# Altium schematic sheet COMMUNICATION.SchDoc
size 420 x 297 mm; SheetNumber: 4; SheetTotal: 5
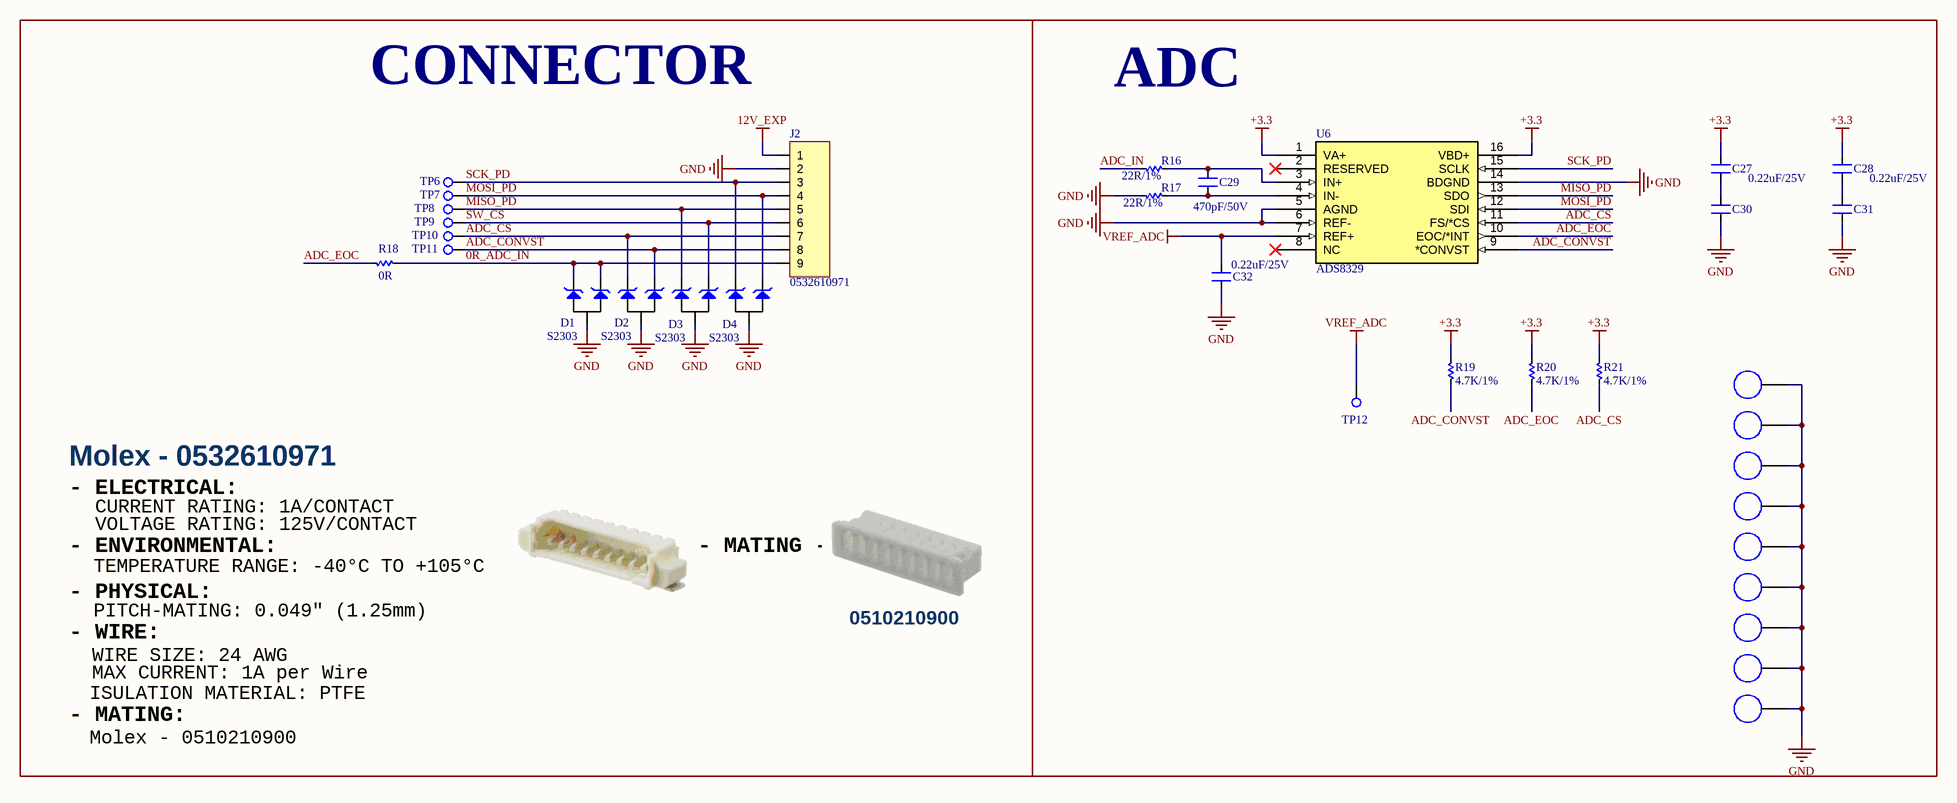
[diagram p0: COMMUNICATION.SchDoc]

## Parts
C27  0.22uF/25V  [CN-SMD-0603]
C28  0.22uF/25V  [CN-SMD-0603]
C29  470pF/50V  [CN-SMD-0603]
C30  0.22uF/25V  [CN-SMD-0603]  (value not drawn)
C31  0.22uF/25V  [CN-SMD-0603]  (value not drawn)
C32  0.22uF/25V  [CN-SMD-0603]
D1  S2303  [SOT23-123]
D2  S2303  [SOT23-123]
D3  S2303  [SOT23-123]
D4  S2303  [SOT23-123]
H1  HOLD  [M3 - 6mm]  (value not drawn)
H2  HOLD  [M3 - 6mm]  (value not drawn)
H3  HOLD  [M3 - 6mm]  (value not drawn)
H4  HOLD  [M3 - 6mm]  (value not drawn)
H5  HOLD  [M3 - 6mm]  (value not drawn)
H6  HOLD  [M3 - 6mm]  (value not drawn)
H7  HOLD  [M3 - 6mm]  (value not drawn)
H8  HOLD  [M3 - 6mm]  (value not drawn)
H9  HOLD  [M3 - 6mm]  (value not drawn)
J2  0532610971  [0532610971]
R16  22R/1%  [RES-SMD-0603]
R17  22R/1%  [RES-SMD-0603]
R18  0R  [RES-SMD-0603]
R19  4.7K/1%  [RES-SMD-0603]
R20  4.7K/1%  [RES-SMD-0603]
R21  4.7K/1%  [RES-SMD-0603]
TP6  Test_Point  [TESTPOINT]  (value not drawn)
TP7  Test_Point  [TESTPOINT]  (value not drawn)
TP8  Test_Point  [TESTPOINT]  (value not drawn)
TP9  Test_Point  [TESTPOINT]  (value not drawn)
TP10  Test_Point  [TESTPOINT]  (value not drawn)
TP11  Test_Point  [TESTPOINT]  (value not drawn)
TP12  Test_Point  [TESTPOINT]  (value not drawn)
U6  ADS8329  [TSSOP16]

## Blocks framed on the sheet
CONNECTOR: D1-D4 J2 R18 TP6-TP11
ADC: C27-C32 H1-H9 R16 R17 R19-R21 TP12 U6

## Nets
12V_EXP: J2.1
+3.3: C27.2 C28.2 R19.2 R20.2 R21.2 U6.1(VA+) U6.16(VBD+)
GND: C30.1 C31.1 C32.1 D1.2 D2.2 D3.2 D4.2 H1.1 H2.1 H3.1 H4.1 H5.1 H6.1 H7.1 H8.1 H9.1 J2.2 R17.2 U6.5(AGND) U6.6(REF-) U6.14(BDGND)
VREF_ADC: C32.2 TP12.1 U6.7(REF+)
0R_ADC_IN: D1.1 D1.3 J2.9 R18.1
ADC_CONVST: D2.3 J2.8 R19.1 TP11.1 U6.9(*CONVST)
ADC_CS: D2.1 J2.7 R21.1 TP10.1 U6.11(FS/*CS)
ADC_EOC: R18.2 R20.1 U6.10(EOC/*INT)
ADC_IN: R16.2
MISO_PD: D3.1 J2.5 TP8.1 U6.13(SDO)
MOSI_PD: D4.3 J2.4 TP7.1 U6.12(SDI)
SCK_PD: D4.1 J2.3 TP6.1 U6.15(SCLK)
SW_CS: D3.3 J2.6 TP9.1
NetC27_1: C27.1 C30.2
NetC28_1: C28.1 C31.2
NetC29_1: C29.1 R17.1 U6.4(IN-)
NetC29_2: C29.2 R16.1 U6.3(IN+)

Not connected (* = marked no-connect by the designer): U6 2(RESERVED)* 8(NC)*

## Notes on the sheet
- Molex - 0532610971
- - ELECTRICAL:
- - ENVIRONMENTAL:
- CURRENT RATING: 1A/CONTACT
- VOLTAGE RATING: 125V/CONTACT
- - MATING -
- - PHYSICAL:
- TEMPERATURE RANGE: -40°C TO +105°C
- PITCH-MATING: 0.049" (1.25mm)
- 0510210900
- - WIRE:
- WIRE SIZE: 24 AWG
- MAX CURRENT: 1A per Wire
- - MATING:
- ISULATION MATERIAL: PTFE
- Molex - 0510210900
- Project:
- BEE-PC1
- Sub-system:
- Design by:
- Hung Nguyen D.
- Bao Bui Q.
- Sheet title:
- Sheet
- A3
- of
- Checked by:
- Approved by:
- Vu Pham
- Revision:
- Document No:
- V1.2.1
- Size:
- Date:

## Library data of the parts
C27 C28 C30-C32 = CM: CL10B224KA8NNNC; Value: 103
C29 = CM: CL10B471KB8NNNC; Value: 103
H1-H9 = PAD_HOLD
J2 = JP9: Manufacturer: W¨¹rth Elektronik eiSos GmbH; partNo: 613009143121; ComponentLink1 Description: Manufacturer; ComponentLink2 Description: Datasheet; NoPins: 09; Created Date: 29 March 2013; ComponentLink1URL: http://www.we-online.com; ComponentLink2URL: http://katalog.we-online.de/em/datasheet/6130xx143121.pdf; Created by: Karrer Zheng
R16 R17 = Res-SMD: ERJ-3EKF22R0V; Manufacturer: Generic Components; Class: Passive; Published: 08/06/2000; Publisher: Altium Hobart Technology Centre
R18 = Res-SMD: ERJ-3GEY0R00V; Manufacturer: Generic Components; Class: Passive; Published: 08/06/2000; Publisher: Altium Hobart Technology Centre
R19-R21 = Res-SMD: ERJ-3EKF4701V; Manufacturer: Generic Components; Class: Passive; Published: 08/06/2000; Publisher: Altium Hobart Technology Centre
U6 = ADS8327: Supplier 1: Mouser; Supplier Part Number 1: 595-ADS8327IPW